# Altium schematic sheet PFC.SchDoc
size A4
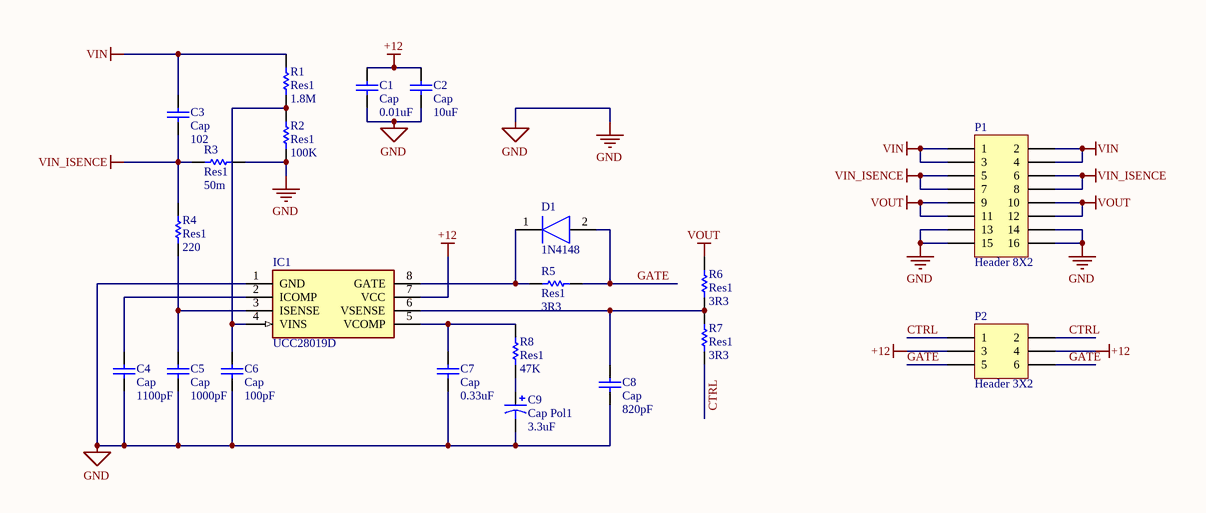
[diagram p0: PFC.SchDoc]

## Parts
C1  Cap  value 0.01uF  [1608[0603]]
C2  Cap  value 10uF  [1608[0603]]
C3  Cap  value 102  [1608[0603]]
C4  Cap  value 1100pF  [1608[0603]]
C5  Cap  value 1000pF  [1608[0603]]
C6  Cap  value 100pF  [1608[0603]]
C7  Cap  value 0.33uF  [1608[0603]]
C8  Cap  value 820pF  [1608[0603]]
C9  Cap Pol1  value 3.3uF  [1608[0603]]
D1  1N4148  [DIOAD1068W53L380D172]
IC1  UCC28019D  [SOIC127P600X175-8N]
P1  Header 8X2  [HDR2X8]
P2  Header 3X2  [HDR2X3]
R1  Res1  value 1.8M  [1608[0603]]
R2  Res1  value 100K  [1608[0603]]
R3  Res1  value 50m  [C1210]
R4  Res1  value 220  [1608[0603]]
R5  Res1  value 3R3  [1608[0603]]
R6  Res1  value 3R3  [1608[0603]]
R7  Res1  value 3R3  [1608[0603]]
R8  Res1  value 47K  [1608[0603]]

## Nets
+12: C1.2 C2.2 IC1.7(VCC) P2.3 P2.4
GND: C1.1 C2.1 C4.1 C5.1 C6.1 C7.1 C8.1 C9.2 IC1.1(GND) P1.13 P1.14 P1.15 P1.16 R2.2 R3.1
VIN: C3.2 P1.1 P1.2 P1.3 P1.4 R1.1
VIN_ISENCE: C3.1 P1.5 P1.6 P1.7 P1.8 R3.2 R4.2
VOUT: P1.9 P1.10 P1.11 P1.12 R6.2
CTRL: P2.1 P2.2 R7.1
GATE: D1.2(A) P2.5 P2.6 R5.2
NetC4_2: C4.2 IC1.2(ICOMP)
NetC5_2: C5.2 IC1.3(ISENSE) R4.1
NetC6_2: C6.2 IC1.4(VINS) R1.2 R2.1
NetC7_2: C7.2 IC1.5(VCOMP) R8.2
NetC8_2: C8.2 IC1.6(VSENSE) R6.1 R7.2
NetC9_1: C9.1 R8.1
NetD1_1: D1.1(K) IC1.8(GATE) R5.1

## Library data of the parts
C1-C8 = Cap: Capacitor; Published: 8-Jun-2000; LatestRevisionDate: 17-Jul-2002; LatestRevisionNote: Re-released for DXP Platform.; PackageReference: RAD-0.3; Publisher: Altium Limited; PackageDescription: Radial Cap, Thru-Hole; 2 Leads; 0.3 in Pin Spacing
C9 = Cap Pol1: Polarized Capacitor (Radial); Published: 8-Jun-2000; LatestRevisionDate: 17-Jul-2002; LatestRevisionNote: Re-released for DXP Platform.; PackageReference: RB7.6-15; Publisher: Altium Limited; PackageDescription: Polarized Capacitor (Radial); 2 Leads
D1 = 1N4148: Diode; Manufacturer_Name: Micro Commercial Components (MCC); Datasheet Link: https://componentsearchengine.com/Datasheets/1/1N4148.pdf; Manufacturer_Part_Number: 1N4148; Mouser Part Number: 833-1N4148; Mouser Price/Stock: https://www.mouser.com/Search/Refine.aspx?Keyword=833-1N4148
IC1 = UCC28019D: Integrated Circuit; Manufacturer_Name: Texas Instruments; Datasheet Link: http://docs-emea.rs-online.com/webdocs/0abc/0900766b80abcb30.pdf; Height: 1.75mm; Manufacturer_Part_Number: UCC28019D; RS Part Number: 0404342P; RS Price/Stock: http://uk.rs-online.com/web/p/products/0404342P
P1 = Header 8X2: Header, 8-Pin, Dual row; LatestRevisionDate: 17-Jul-2002; LatestRevisionNote: Re-released for DXP Platform.; Publisher: Altium Limited
P2 = Header 3X2: Header, 3-Pin, Dual row; LatestRevisionDate: 17-Jul-2002; LatestRevisionNote: Re-released for DXP Platform.; Publisher: Altium Limited
R1-R8 = Res1: Resistor; Published: 8-Jun-2000; LatestRevisionDate: 17-Jul-2002; LatestRevisionNote: Re-released for DXP Platform.; PackageReference: AXIAL-0.3; Publisher: Altium Limited; PackageDescription: Axial Device, Thru-Hole; 2 Leads; 0.3 in Pin Spacing